# EAGLE design 5_cpu_alu (EAGLE 6.6.0)

## Sheet 1 of 2
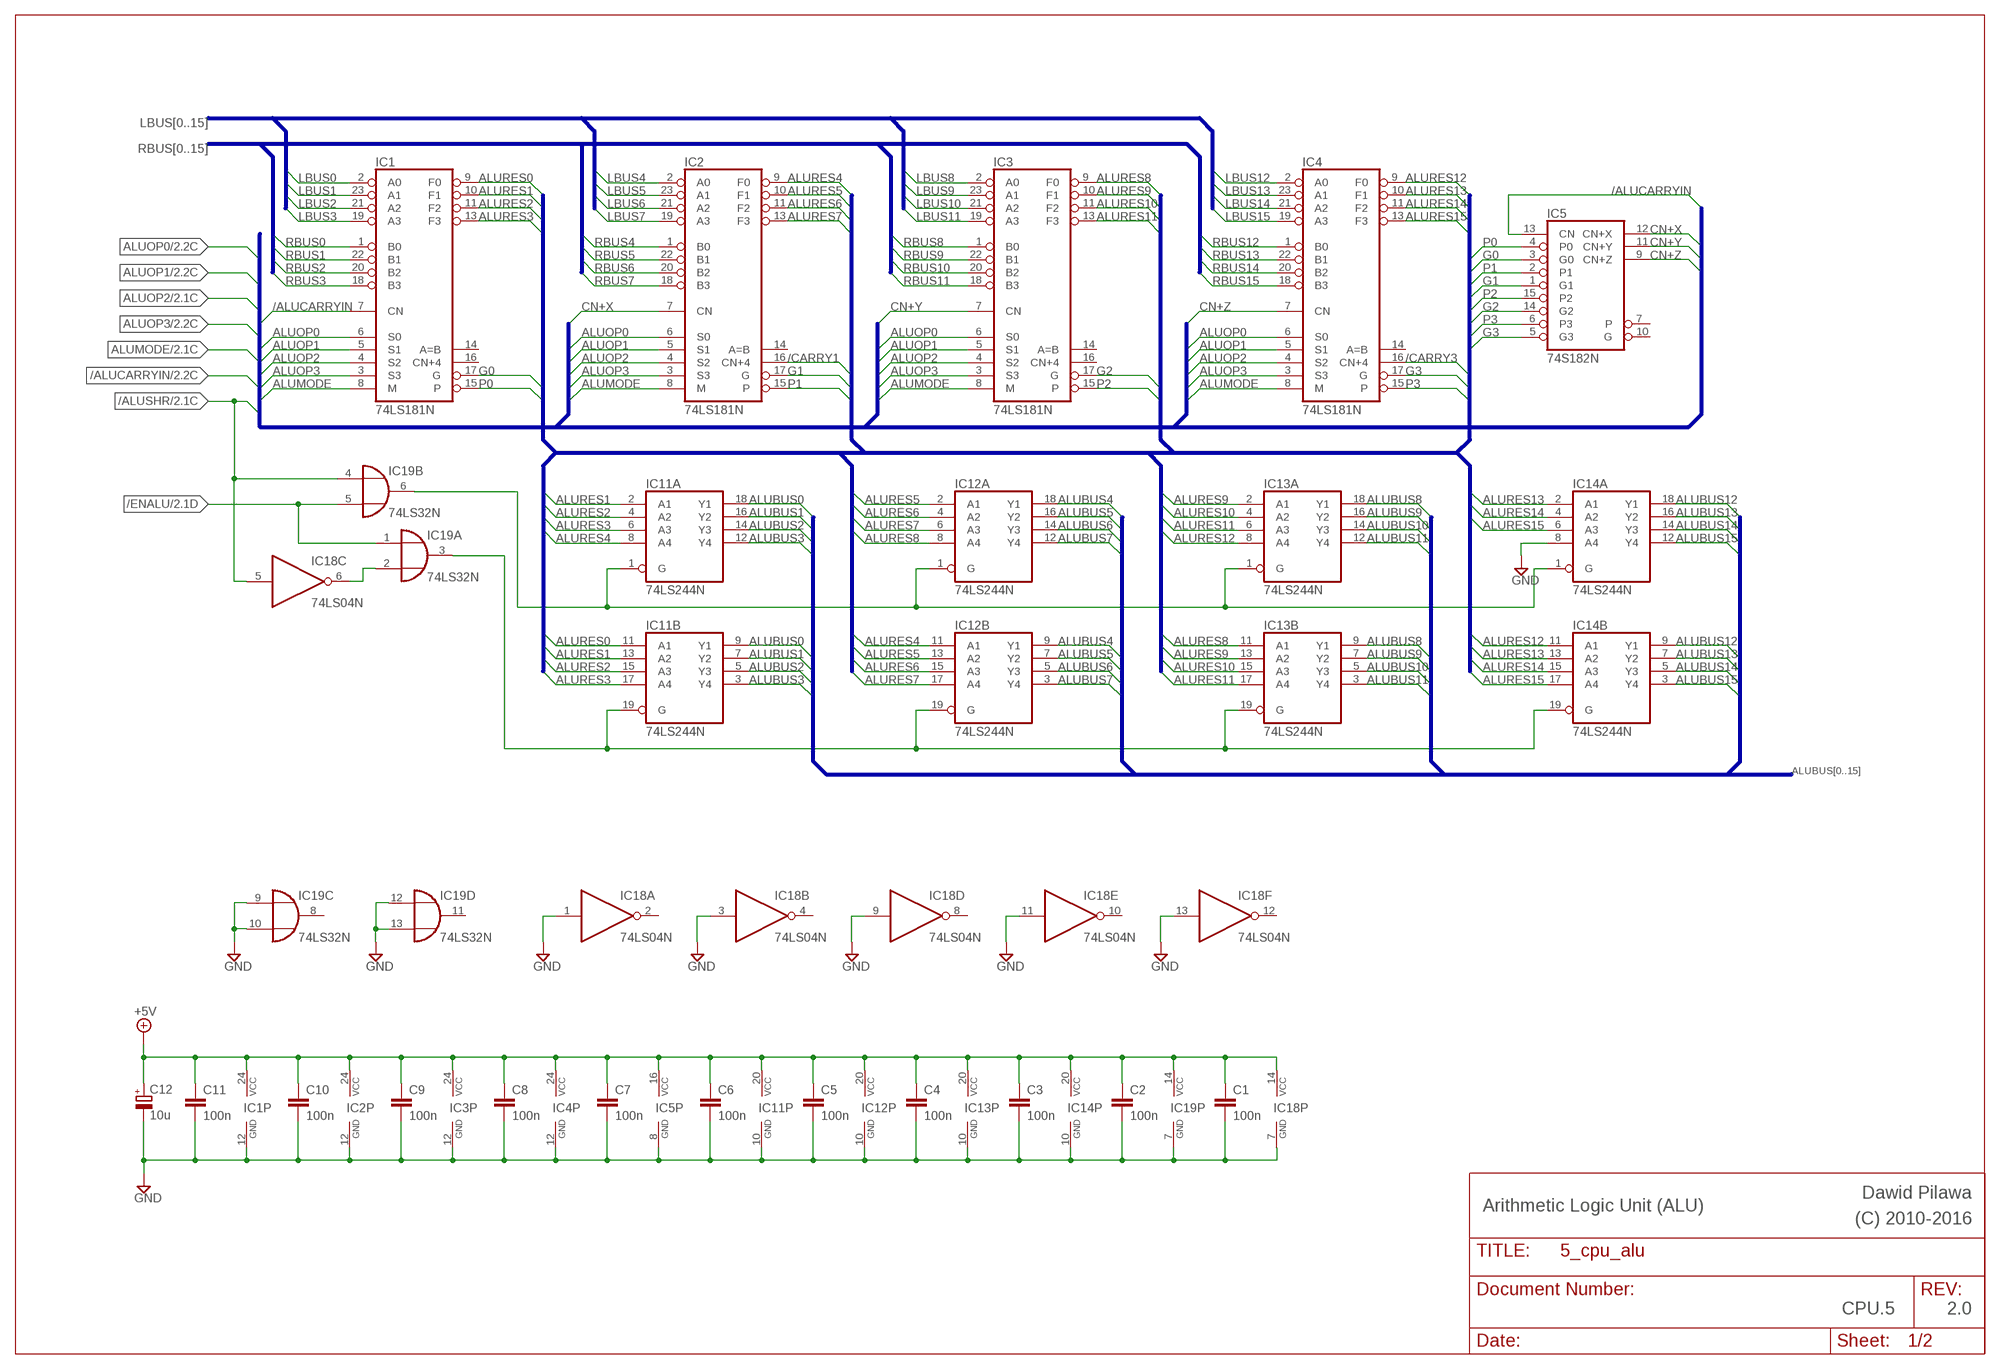
[diagram p0: schematic, sheet 1]

### Parts
C1  100n  C-EU050-024X044  [C050-024X044]
C2  100n  C-EU050-024X044  [C050-024X044]
C3  100n  C-EU050-024X044  [C050-024X044]
C4  100n  C-EU050-024X044  [C050-024X044]
C5  100n  C-EU050-024X044  [C050-024X044]
C6  100n  C-EU050-024X044  [C050-024X044]
C7  100n  C-EU050-024X044  [C050-024X044]
C8  100n  C-EU050-024X044  [C050-024X044]
C9  100n  C-EU050-024X044  [C050-024X044]
C10  100n  C-EU050-024X044  [C050-024X044]
C11  100n  C-EU050-024X044  [C050-024X044]
C12  10u  CPOL-EUE2.5-6  [E2,5-6]
IC1  74LS181N  [DIL24-6]
IC2  74LS181N  [DIL24-6]
IC3  74LS181N  [DIL24-6]
IC4  74LS181N  [DIL24-6]
IC5  74S182N  [DIL16]
IC11  74LS244N  [DIL20]
IC12  74LS244N  [DIL20]
IC13  74LS244N  [DIL20]
IC14  74LS244N  [DIL20]
IC18  74LS04N  [DIL14]
IC19  74LS32N  [DIL14]

### Nets
+5V: C1.1 C2.1 C3.1 C4.1 C5.1 C6.1 C7.1 C8.1 C9.1 C10.1 C11.1 C12.+ IC1.24(VCC) IC2.24(VCC) IC3.24(VCC) IC4.24(VCC) IC5.16(VCC) IC11.20(P:VCC) IC12.20(P:VCC) IC13.20(P:VCC) IC14.20(P:VCC) IC18.14(P:VCC) IC19.14(P:VCC) ; also sheet 2
/ALUCARRYIN: IC1.7(CN) IC5.13(CN) ; also sheet 2
/ALUSHR: IC18.5(C:I) IC19.4(B:I0) ; also sheet 2
/CARRY1: IC2.16(CN+4) ; also sheet 2
/CARRY3: IC4.16(CN+4) ; also sheet 2
/ENALU: IC19.1(A:I0) IC19.5(B:I1) ; also sheet 2
ALUBUS0: IC11.9(B:Y1) IC11.18(A:Y1) ; also sheet 2
ALUBUS1: IC11.7(B:Y2) IC11.16(A:Y2) ; also sheet 2
ALUBUS2: IC11.5(B:Y3) IC11.14(A:Y3) ; also sheet 2
ALUBUS3: IC11.3(B:Y4) IC11.12(A:Y4) ; also sheet 2
ALUBUS4: IC12.9(B:Y1) IC12.18(A:Y1) ; also sheet 2
ALUBUS5: IC12.7(B:Y2) IC12.16(A:Y2) ; also sheet 2
ALUBUS6: IC12.5(B:Y3) IC12.14(A:Y3) ; also sheet 2
ALUBUS7: IC12.3(B:Y4) IC12.12(A:Y4) ; also sheet 2
ALUBUS8: IC13.9(B:Y1) IC13.18(A:Y1) ; also sheet 2
ALUBUS9: IC13.7(B:Y2) IC13.16(A:Y2) ; also sheet 2
ALUBUS10: IC13.5(B:Y3) IC13.14(A:Y3) ; also sheet 2
ALUBUS11: IC13.3(B:Y4) IC13.12(A:Y4) ; also sheet 2
ALUBUS12: IC14.9(B:Y1) IC14.18(A:Y1) ; also sheet 2
ALUBUS13: IC14.7(B:Y2) IC14.16(A:Y2) ; also sheet 2
ALUBUS14: IC14.5(B:Y3) IC14.14(A:Y3) ; also sheet 2
ALUBUS15: IC14.3(B:Y4) IC14.12(A:Y4) ; also sheet 2
ALUMODE: IC1.8(M) IC2.8(M) IC3.8(M) IC4.8(M) ; also sheet 2
ALUOP0: IC1.6(S0) IC2.6(S0) IC3.6(S0) IC4.6(S0) ; also sheet 2
ALUOP1: IC1.5(S1) IC2.5(S1) IC3.5(S1) IC4.5(S1) ; also sheet 2
ALUOP2: IC1.4(S2) IC2.4(S2) IC3.4(S2) IC4.4(S2) ; also sheet 2
ALUOP3: IC1.3(S3) IC2.3(S3) IC3.3(S3) IC4.3(S3) ; also sheet 2
ALURES0: IC1.9(F0) IC11.11(B:A1) ; also sheet 2
ALURES1: IC1.10(F1) IC11.2(A:A1) IC11.13(B:A2)
ALURES2: IC1.11(F2) IC11.4(A:A2) IC11.15(B:A3)
ALURES3: IC1.13(F3) IC11.6(A:A3) IC11.17(B:A4)
ALURES4: IC2.9(F0) IC11.8(A:A4) IC12.11(B:A1)
ALURES5: IC2.10(F1) IC12.2(A:A1) IC12.13(B:A2)
ALURES6: IC2.11(F2) IC12.4(A:A2) IC12.15(B:A3)
ALURES7: IC2.13(F3) IC12.6(A:A3) IC12.17(B:A4)
ALURES8: IC3.9(F0) IC12.8(A:A4) IC13.11(B:A1) ; also sheet 2
ALURES9: IC3.10(F1) IC13.2(A:A1) IC13.13(B:A2)
ALURES10: IC3.11(F2) IC13.4(A:A2) IC13.15(B:A3)
ALURES11: IC3.13(F3) IC13.6(A:A3) IC13.17(B:A4)
ALURES12: IC4.9(F0) IC13.8(A:A4) IC14.11(B:A1)
ALURES13: IC4.10(F1) IC14.2(A:A1) IC14.13(B:A2)
ALURES14: IC4.11(F2) IC14.4(A:A2) IC14.15(B:A3)
ALURES15: IC4.13(F3) IC14.6(A:A3) IC14.17(B:A4)
CN+X: IC2.7(CN) IC5.12(CN+X)
CN+Y: IC3.7(CN) IC5.11(CN+Y)
CN+Z: IC4.7(CN) IC5.9(CN+Z)
G0: IC1.17(G) IC5.3(G0)
G1: IC2.17(G) IC5.1(G1)
G2: IC3.17(G) IC5.14(G2)
G3: IC4.17(G) IC5.5(G3)
GND: C1.2 C2.2 C3.2 C4.2 C5.2 C6.2 C7.2 C8.2 C9.2 C10.2 C11.2 C12.- IC1.12(GND) IC2.12(GND) IC3.12(GND) IC4.12(GND) IC5.8(GND) IC11.10(P:GND) IC12.10(P:GND) IC13.10(P:GND) IC14.8(A:A4) IC14.10(P:GND) IC18.1(A:I) IC18.3(B:I) IC18.7(P:GND) IC18.9(D:I) IC18.11(E:I) IC18.13(F:I) IC19.7(P:GND) IC19.9(C:I0) IC19.10(C:I1) IC19.12(D:I0) IC19.13(D:I1) ; also sheet 2
LBUS0: IC1.2(A0) ; also sheet 2
LBUS1: IC1.23(A1) ; also sheet 2
LBUS2: IC1.21(A2) ; also sheet 2
LBUS3: IC1.19(A3) ; also sheet 2
LBUS4: IC2.2(A0) ; also sheet 2
LBUS5: IC2.23(A1) ; also sheet 2
LBUS6: IC2.21(A2) ; also sheet 2
LBUS7: IC2.19(A3) ; also sheet 2
LBUS8: IC3.2(A0) ; also sheet 2
LBUS9: IC3.23(A1) ; also sheet 2
LBUS10: IC3.21(A2) ; also sheet 2
LBUS11: IC3.19(A3) ; also sheet 2
LBUS12: IC4.2(A0) ; also sheet 2
LBUS13: IC4.23(A1) ; also sheet 2
LBUS14: IC4.21(A2) ; also sheet 2
LBUS15: IC4.19(A3) ; also sheet 2
N$1: IC11.1(A:G) IC12.1(A:G) IC13.1(A:G) IC14.1(A:G) IC19.6(B:O)
N$4: IC18.6(C:O) IC19.2(A:I1)
N$5: IC11.19(B:G) IC12.19(B:G) IC13.19(B:G) IC14.19(B:G) IC19.3(A:O)
P0: IC1.15(P) IC5.4(P0)
P1: IC2.15(P) IC5.2(P1)
P2: IC3.15(P) IC5.15(P2)
P3: IC4.15(P) IC5.6(P3)
RBUS0: IC1.1(B0) ; also sheet 2
RBUS1: IC1.22(B1) ; also sheet 2
RBUS2: IC1.20(B2) ; also sheet 2
RBUS3: IC1.18(B3) ; also sheet 2
RBUS4: IC2.1(B0) ; also sheet 2
RBUS5: IC2.22(B1) ; also sheet 2
RBUS6: IC2.20(B2) ; also sheet 2
RBUS7: IC2.18(B3) ; also sheet 2
RBUS8: IC3.1(B0) ; also sheet 2
RBUS9: IC3.22(B1) ; also sheet 2
RBUS10: IC3.20(B2) ; also sheet 2
RBUS11: IC3.18(B3) ; also sheet 2
RBUS12: IC4.1(B0) ; also sheet 2
RBUS13: IC4.22(B1) ; also sheet 2
RBUS14: IC4.20(B2) ; also sheet 2
RBUS15: IC4.18(B3) ; also sheet 2
Unconnected: IC1.14(A=B) IC1.16(CN+4) IC2.14(A=B) IC3.14(A=B) IC3.16(CN+4) IC4.14(A=B) IC5.7(P) IC5.10(G) IC18.2(A:O) IC18.4(B:O) IC18.8(D:O) IC18.10(E:O) IC18.12(F:O) IC19.8(C:O) IC19.11(D:O)

### Buses
RBUS[0..15]
LBUS[0..15]
ALUOP[0..3],ALUMODE,/ALUSHR,/ALUCARRYIN,CN+X,CN+Y,CN+Z
ALURES[0..15],/CARRY[0..3],P[0..3],G[0..3]
ALUBUS[0..15]

### Notes on the sheet
- Dawid Pilawa
- Arithmetic Logic Unit (ALU) | (C) 2010-2016
- CPU.5 | 2.0

## Sheet 2 of 2
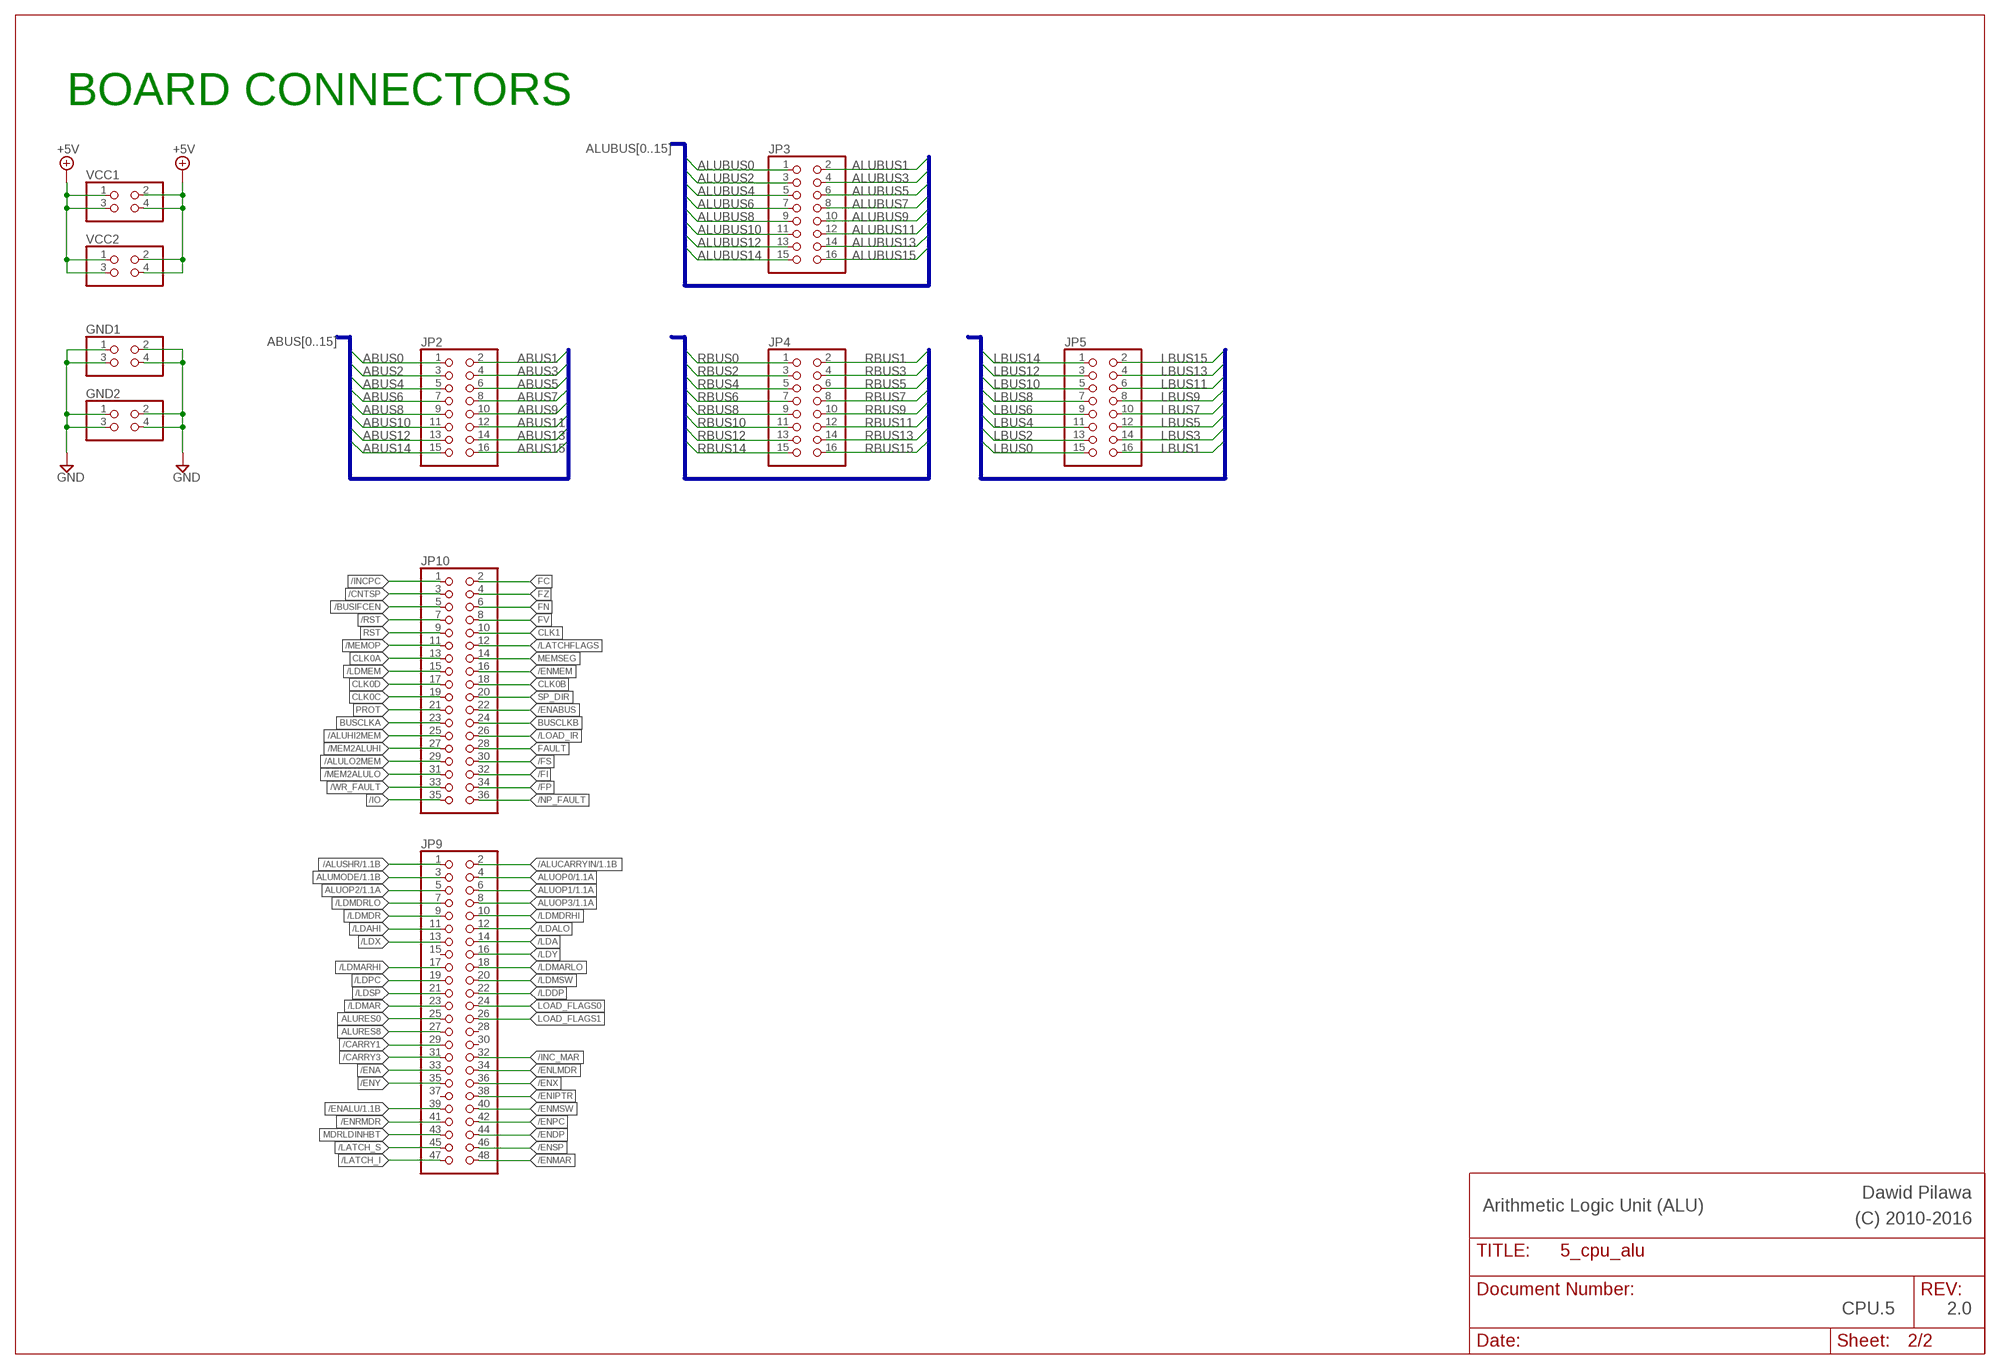
[diagram p1: schematic, sheet 2]

### Parts
GND1  PINHD-2X2  [2X02]
GND2  PINHD-2X2  [2X02]
JP2  PINHD-2X8  [2X08]
JP3  PINHD-2X8  [2X08]
JP4  PINHD-2X8  [2X08]
JP5  PINHD-2X8  [2X08]
JP9  PINHD-2X24  [2X24]
JP10  PINHD-2X18  [2X18]
VCC1  PINHD-2X2  [2X02]
VCC2  PINHD-2X2  [2X02]

### Nets
+5V: VCC1.1 VCC1.2 VCC1.3 VCC1.4 VCC2.1 VCC2.2 VCC2.3 VCC2.4 ; also sheet 1
/ALUCARRYIN: JP9.2 ; also sheet 1
/ALUHI2MEM: JP10.25
/ALULO2MEM: JP10.29
/ALUSHR: JP9.1 ; also sheet 1
/BUSIFCEN: JP10.5
/CARRY1: JP9.29 ; also sheet 1
/CARRY3: JP9.31 ; also sheet 1
/CNTSP: JP10.3
/ENA: JP9.33
/ENABUS: JP10.22
/ENALU: JP9.39 ; also sheet 1
/ENDP: JP9.44
/ENIPTR: JP9.38
/ENLMDR: JP9.34
/ENMAR: JP9.48
/ENMEM: JP10.16
/ENMSW: JP9.40
/ENPC: JP9.42
/ENRMDR: JP9.41
/ENSP: JP9.46
/ENX: JP9.36
/ENY: JP9.35
/FI: JP10.32
/FP: JP10.34
/FS: JP10.30
/INC_MAR: JP9.32
/INCPC: JP10.1
/IO: JP10.35
/LATCH_I: JP9.47
/LATCH_S: JP9.45
/LATCHFLAGS: JP10.12
/LDA: JP9.14
/LDAHI: JP9.11
/LDALO: JP9.12
/LDDP: JP9.22
/LDMAR: JP9.23
/LDMARHI: JP9.17
/LDMARLO: JP9.18
/LDMDR: JP9.9
/LDMDRHI: JP9.10
/LDMDRLO: JP9.7
/LDMEM: JP10.15
/LDMSW: JP9.20
/LDPC: JP9.19
/LDSP: JP9.21
/LDX: JP9.13
/LDY: JP9.16
/LOAD_IR: JP10.26
/MEM2ALUHI: JP10.27
/MEM2ALULO: JP10.31
/MEMOP: JP10.11
/NP_FAULT: JP10.36
/RST: JP10.7
/WR_FAULT: JP10.33
ABUS0: JP2.1
ABUS1: JP2.2
ABUS2: JP2.3
ABUS3: JP2.4
ABUS4: JP2.5
ABUS5: JP2.6
ABUS6: JP2.7
ABUS7: JP2.8
ABUS8: JP2.9
ABUS9: JP2.10
ABUS10: JP2.11
ABUS11: JP2.12
ABUS12: JP2.13
ABUS13: JP2.14
ABUS14: JP2.15
ABUS15: JP2.16
ALUBUS0: JP3.1 ; also sheet 1
ALUBUS1: JP3.2 ; also sheet 1
ALUBUS2: JP3.3 ; also sheet 1
ALUBUS3: JP3.4 ; also sheet 1
ALUBUS4: JP3.5 ; also sheet 1
ALUBUS5: JP3.6 ; also sheet 1
ALUBUS6: JP3.7 ; also sheet 1
ALUBUS7: JP3.8 ; also sheet 1
ALUBUS8: JP3.9 ; also sheet 1
ALUBUS9: JP3.10 ; also sheet 1
ALUBUS10: JP3.11 ; also sheet 1
ALUBUS11: JP3.12 ; also sheet 1
ALUBUS12: JP3.13 ; also sheet 1
ALUBUS13: JP3.14 ; also sheet 1
ALUBUS14: JP3.15 ; also sheet 1
ALUBUS15: JP3.16 ; also sheet 1
ALUMODE: JP9.3 ; also sheet 1
ALUOP0: JP9.4 ; also sheet 1
ALUOP1: JP9.6 ; also sheet 1
ALUOP2: JP9.5 ; also sheet 1
ALUOP3: JP9.8 ; also sheet 1
ALURES0: JP9.25 ; also sheet 1
ALURES8: JP9.27 ; also sheet 1
BUSCLKA: JP10.23
BUSCLKB: JP10.24
CLK0A: JP10.13
CLK0B: JP10.18
CLK0C: JP10.19
CLK0D: JP10.17
CLK1: JP10.10
FAULT: JP10.28
FC: JP10.2
FN: JP10.6
FV: JP10.8
FZ: JP10.4
GND: GND1.1 GND1.2 GND1.3 GND1.4 GND2.1 GND2.2 GND2.3 GND2.4 ; also sheet 1
LBUS0: JP5.15 ; also sheet 1
LBUS1: JP5.16 ; also sheet 1
LBUS2: JP5.13 ; also sheet 1
LBUS3: JP5.14 ; also sheet 1
LBUS4: JP5.11 ; also sheet 1
LBUS5: JP5.12 ; also sheet 1
LBUS6: JP5.9 ; also sheet 1
LBUS7: JP5.10 ; also sheet 1
LBUS8: JP5.7 ; also sheet 1
LBUS9: JP5.8 ; also sheet 1
LBUS10: JP5.5 ; also sheet 1
LBUS11: JP5.6 ; also sheet 1
LBUS12: JP5.3 ; also sheet 1
LBUS13: JP5.4 ; also sheet 1
LBUS14: JP5.1 ; also sheet 1
LBUS15: JP5.2 ; also sheet 1
LOAD_FLAGS0: JP9.24
LOAD_FLAGS1: JP9.26
MDRLDINHBT: JP9.43
MEMSEG: JP10.14
PROT: JP10.21
RBUS0: JP4.1 ; also sheet 1
RBUS1: JP4.2 ; also sheet 1
RBUS2: JP4.3 ; also sheet 1
RBUS3: JP4.4 ; also sheet 1
RBUS4: JP4.5 ; also sheet 1
RBUS5: JP4.6 ; also sheet 1
RBUS6: JP4.7 ; also sheet 1
RBUS7: JP4.8 ; also sheet 1
RBUS8: JP4.9 ; also sheet 1
RBUS9: JP4.10 ; also sheet 1
RBUS10: JP4.11 ; also sheet 1
RBUS11: JP4.12 ; also sheet 1
RBUS12: JP4.13 ; also sheet 1
RBUS13: JP4.14 ; also sheet 1
RBUS14: JP4.15 ; also sheet 1
RBUS15: JP4.16 ; also sheet 1
RST: JP10.9
SP_DIR: JP10.20
Unconnected: JP9.15 JP9.28 JP9.30 JP9.37

### Buses
RBUS[0..15]
LBUS[0..15]
ALUBUS[0..15]
ABUS[0..15]

### Notes on the sheet
- BOARD CONNECTORS
- Dawid Pilawa
- Arithmetic Logic Unit (ALU) | (C) 2010-2016
- CPU.5 | 2.0

## Library data of the parts
C1-C11 = rcl:C-EU: CAPACITOR, European symbol
C12 = rcl:CPOL-EU: POLARIZED CAPACITOR, European symbol
GND1 GND2 VCC1 VCC2 = pinhead:PINHD-2X2: PIN HEADER
IC1-IC4 = 74xx-eu:74*181: ARITHMETIC LOGIC UNIT function generator
IC5 = 74xx-eu:74*182: LOOK AHEAD CARRY GENERATOR
IC11-IC14 = 74xx-eu:74*244: Octal BUFFER and LINE DRIVER, 3-state
IC18 = 74xx-eu:74*04: Hex INVERTER
IC19 = 74xx-eu:74*32: Quad 2-input OR gate
JP2-JP5 = pinhead:PINHD-2X8: PIN HEADER
JP9 = pinhead:PINHD-2X24: PIN HEADER
JP10 = pinhead:PINHD-2X18: PIN HEADER

## Board
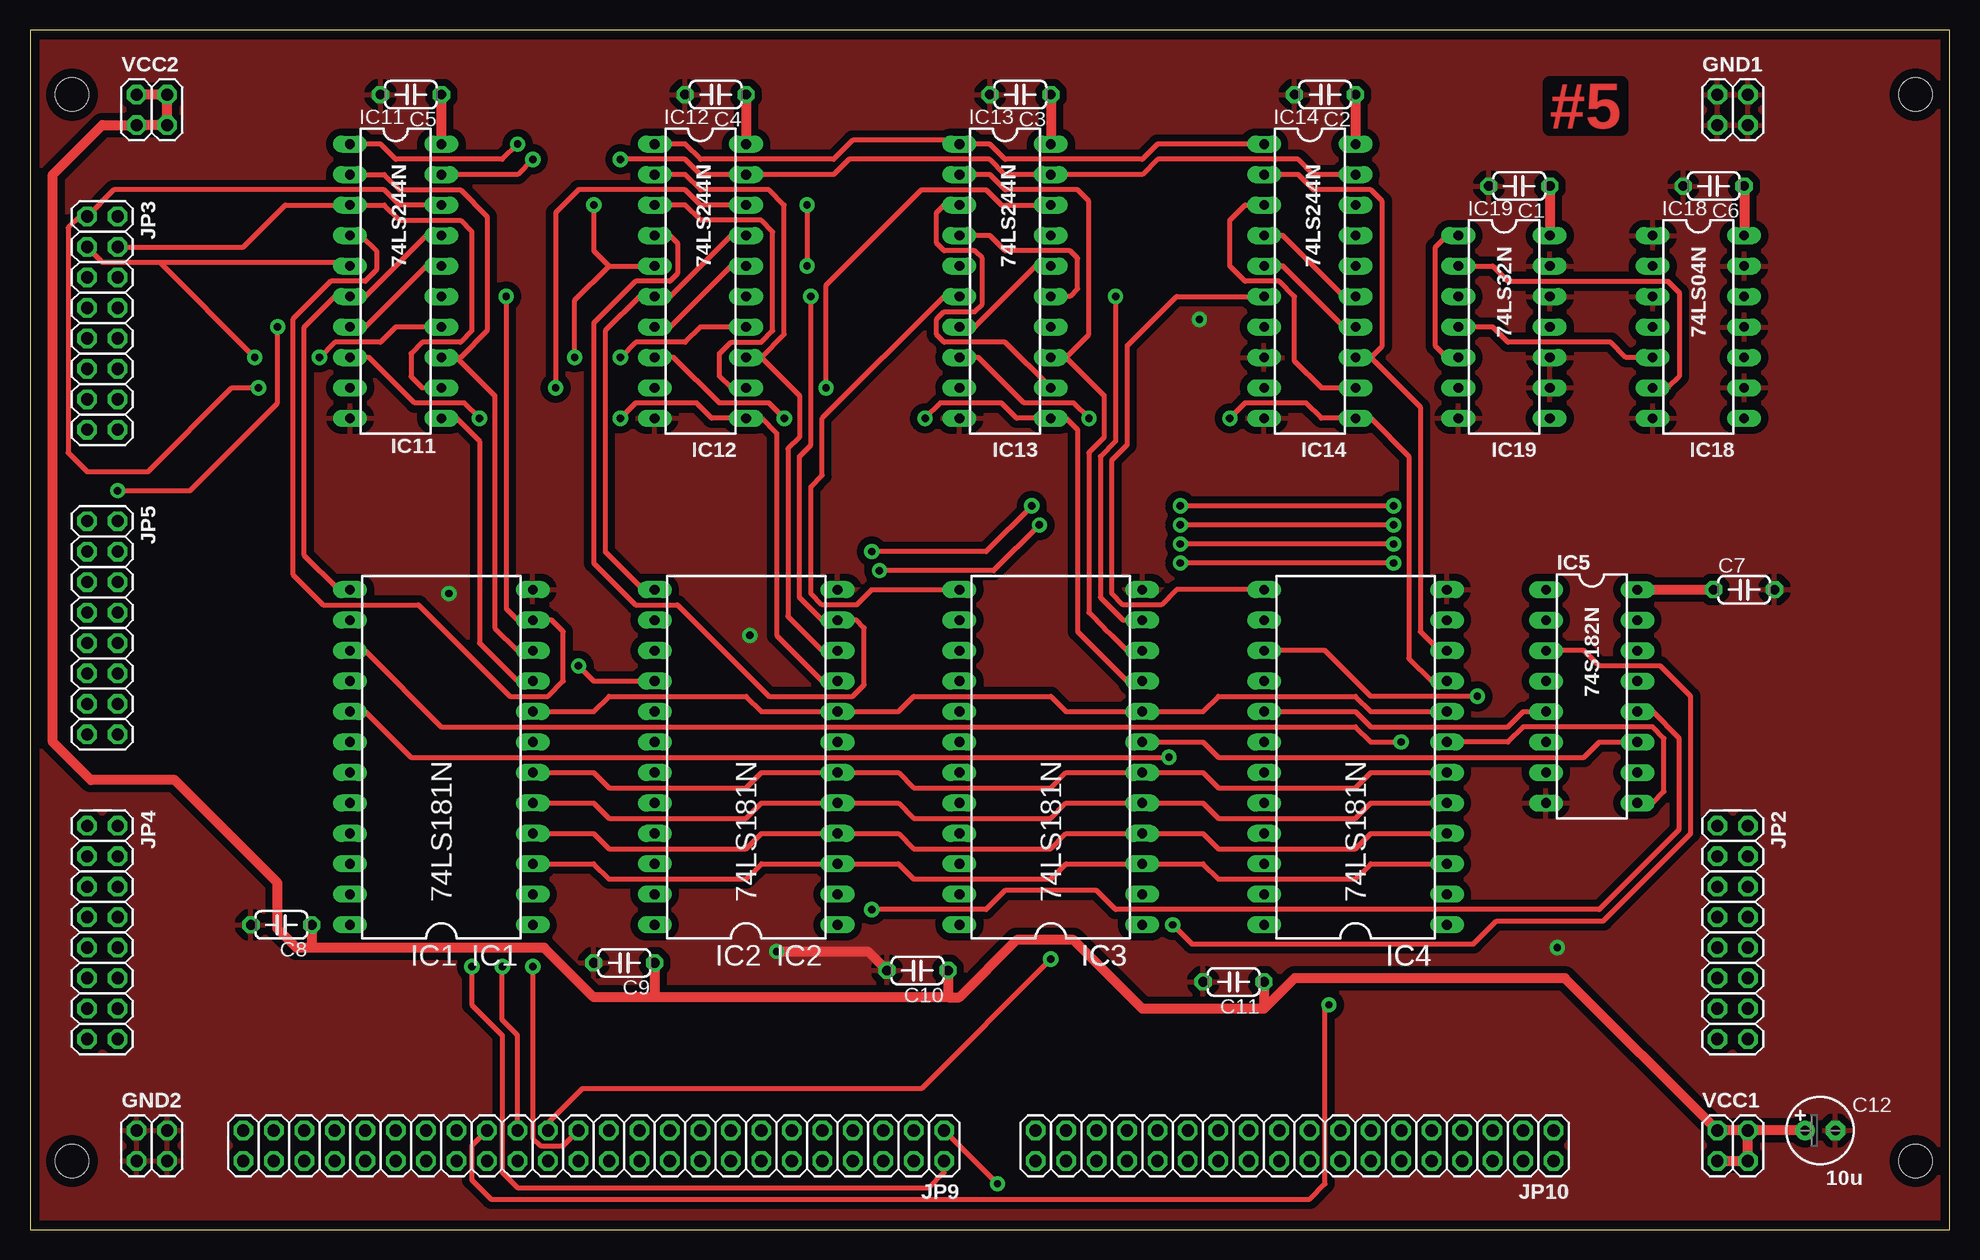
[diagram p2: board, top side]
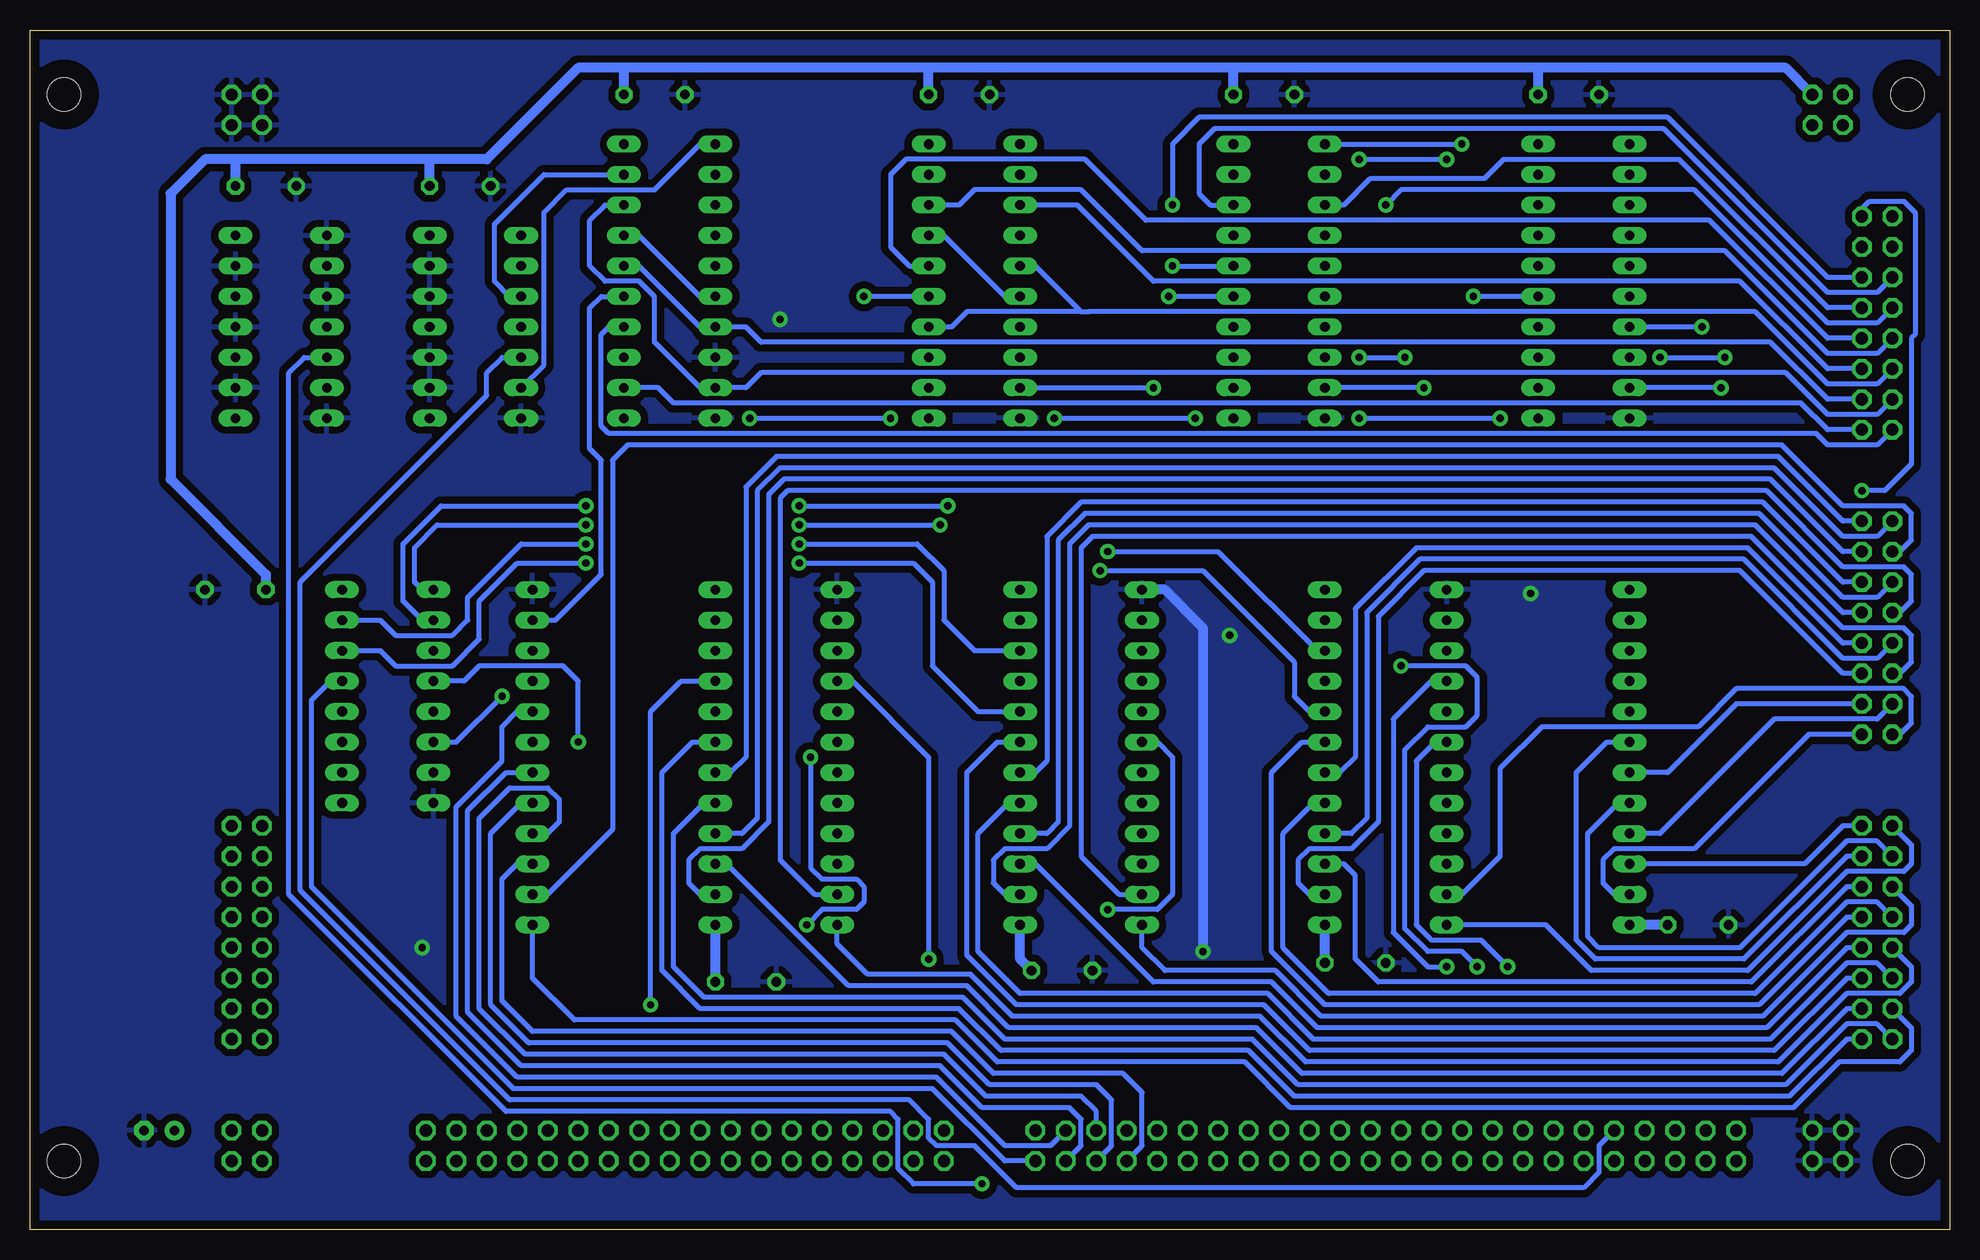
[diagram p3: board, bottom side, seen from below]

Size 160 x 100 mm. Coordinates in mm from the lower left corner, seen from the top.
Outline: 0,0 160,0 160,100 0,100 0,0
Copper layers (1*16): Top 0.035mm / dielectric 1.5mm / Bottom 0.035mm
Design rules "homebrew_pcb": minimum track width 16mil, minimum drill 24mil, track to track 16mil, track to pad 10mil, pad to pad 10mil, via to via 10mil, smd to smd 8mil, copper to edge 30mil, drill to drill 10mil, minimum pad ring 12mil, minimum via ring 12mil, stop-mask expansion 4mil, vias tented up to drill 0mil, thermal gap 24mil
Holes 2.79 mm at 3.49,94.61 3.49,5.71 157.16,5.71 157.16,94.61
bRestrict: area 1.2,92.3 to 5.8,96.9; area 1.2,3.4 to 5.8,8; area 154.9,3.4 to 159.4,8; area 154.9,92.3 to 159.4,96.9
vRestrict: area 1.2,92.3 to 5.8,96.9; area 1.2,3.4 to 5.8,8; area 154.9,3.4 to 159.4,8; area 154.9,92.3 to 159.4,96.9

### Footprints (pad centres in the part's own frame; a part is rotated, then mirrored left to right if it is on the bottom)
C050-024X044 = drill 0.813 octagon: 1 -2.54,0; 2 2.54,0
E2,5-6 = drill 0.813 pad 1.6: + -1.27,0 | drill 0.813 pad 1.6 octagon: - 1.27,0
2X02 = drill 1.016 octagon: 1 -1.27,-1.27; 2 -1.27,1.27; 3 1.27,-1.27; 4 1.27,1.27
DIL24-6 = drill 0.813 long: 1 -13.97,-7.62; 2 -11.43,-7.62; 3 -8.89,-7.62; 4 -6.35,-7.62; 5 -3.81,-7.62; 6 -1.27,-7.62; 7 1.27,-7.62; 8 3.81,-7.62; 9 6.35,-7.62; 10 8.89,-7.62; 11 11.43,-7.62; 12 13.97,-7.62; 13 13.97,7.62; 14 11.43,7.62; 15 8.89,7.62; 16 6.35,7.62; 17 3.81,7.62; 18 1.27,7.62; 19 -1.27,7.62; 20 -3.81,7.62; 21 -6.35,7.62; 22 -8.89,7.62; 23 -11.43,7.62; 24 -13.97,7.62
DIL16 = drill 0.813 long: 1 -8.89,-3.81; 2 -6.35,-3.81; 3 -3.81,-3.81; 4 -1.27,-3.81; 5 1.27,-3.81; 6 3.81,-3.81; 7 6.35,-3.81; 8 8.89,-3.81; 9 8.89,3.81; 10 6.35,3.81; 11 3.81,3.81; 12 1.27,3.81; 13 -1.27,3.81; 14 -3.81,3.81; 15 -6.35,3.81; 16 -8.89,3.81
DIL20 = drill 0.813 long: 1 -11.43,-3.81; 2 -8.89,-3.81; 3 -6.35,-3.81; 4 -3.81,-3.81; 5 -1.27,-3.81; 6 1.27,-3.81; 7 3.81,-3.81; 8 6.35,-3.81; 9 8.89,-3.81; 10 11.43,-3.81; 11 11.43,3.81; 12 8.89,3.81; 13 6.35,3.81; 14 3.81,3.81; 15 1.27,3.81; 16 -1.27,3.81; 17 -3.81,3.81; 18 -6.35,3.81; 19 -8.89,3.81; 20 -11.43,3.81
DIL14 = drill 0.813 long: 1 -7.62,-3.81; 2 -5.08,-3.81; 3 -2.54,-3.81; 4 0,-3.81; 5 2.54,-3.81; 6 5.08,-3.81; 7 7.62,-3.81; 8 7.62,3.81; 9 5.08,3.81; 10 2.54,3.81; 11 0,3.81; 12 -2.54,3.81; 13 -5.08,3.81; 14 -7.62,3.81
2X08 = drill 1.016 octagon: 1 -8.89,-1.27; 2 -8.89,1.27; 3 -6.35,-1.27; 4 -6.35,1.27; 5 -3.81,-1.27; 6 -3.81,1.27; 7 -1.27,-1.27; 8 -1.27,1.27; 9 1.27,-1.27; 10 1.27,1.27; 11 3.81,-1.27; 12 3.81,1.27; 13 6.35,-1.27; 14 6.35,1.27; 15 8.89,-1.27; 16 8.89,1.27
2X24 = drill 1.016 octagon: 1 -27.94,-1.27; 2 -27.94,1.27; 3 -25.4,-1.27; 4 -25.4,1.27; 5 -22.86,-1.27; 6 -22.86,1.27; 7 -20.32,-1.27; 8 -20.32,1.27; 9 -17.78,-1.27; 10 -17.78,1.27; 11 -15.24,-1.27; 12 -15.24,1.27; 13 -12.7,-1.27; 14 -12.7,1.27; 15 -10.16,-1.27; 16 -10.16,1.27; 17 -7.62,-1.27; 18 -7.62,1.27; 19 -5.08,-1.27; 20 -5.08,1.27; 21 -2.54,-1.27; 22 -2.54,1.27; 23 0,-1.27; 24 0,1.27; 25 2.54,-1.27; 26 2.54,1.27; 27 5.08,-1.27; 28 5.08,1.27; 29 7.62,-1.27; 30 7.62,1.27; 31 10.16,-1.27; 32 10.16,1.27; 33 12.7,-1.27; 34 12.7,1.27; 35 15.24,-1.27; 36 15.24,1.27; 37 17.78,-1.27; 38 17.78,1.27; 39 20.32,-1.27; 40 20.32,1.27; 41 22.86,-1.27; 42 22.86,1.27; 43 25.4,-1.27; 44 25.4,1.27; 45 27.94,-1.27; 46 27.94,1.27; 47 30.48,-1.27; 48 30.48,1.27
2X18 = drill 1.016 octagon: 1 -21.59,-1.27; 2 -21.59,1.27; 3 -19.05,-1.27; 4 -19.05,1.27; 5 -16.51,-1.27; 6 -16.51,1.27; 7 -13.97,-1.27; 8 -13.97,1.27; 9 -11.43,-1.27; 10 -11.43,1.27; 11 -8.89,-1.27; 12 -8.89,1.27; 13 -6.35,-1.27; 14 -6.35,1.27; 15 -3.81,-1.27; 16 -3.81,1.27; 17 -1.27,-1.27; 18 -1.27,1.27; 19 1.27,-1.27; 20 1.27,1.27; 21 3.81,-1.27; 22 3.81,1.27; 23 6.35,-1.27; 24 6.35,1.27; 25 8.89,-1.27; 26 8.89,1.27; 27 11.43,-1.27; 28 11.43,1.27; 29 13.97,-1.27; 30 13.97,1.27; 31 16.51,-1.27; 32 16.51,1.27; 33 19.05,-1.27; 34 19.05,1.27; 35 21.59,-1.27; 36 21.59,1.27

### Placement (x,y rotation side)
C1  124.14,87 180 top
C2  107.95,94.61 180 top
C3  82.55,94.61 180 top
C4  57.15,94.61 180 top
C5  31.75,94.61 180 top
C6  140.34,87 180 top
C7  142.88,53.34 0 top
C8  20.95,25.4 180 top
C9  49.53,22.23 180 top
C10  73.98,21.59 180 top
C11  100.33,20.64 180 top
C12  149.22,8.26 0 top
GND1  141.92,93.34 0 top
GND2  10.16,6.99 0 top
IC1  34.29,39.37 90 top
IC2  59.69,39.37 90 top
IC3  85.09,39.37 90 top
IC4  110.49,39.37 90 top
IC5  130.18,44.45 270 top
IC11  30.48,79.06 270 top
IC12  55.88,79.06 270 top
IC13  81.28,79.06 270 top
IC14  106.68,79.06 270 top
IC18  139.06,75.25 270 top
IC19  122.87,75.25 270 top
JP2  141.92,24.77 270 top
JP3  6.03,75.56 270 top
JP4  6.03,24.77 270 top
JP5  6.03,50.16 270 top
JP9  48.26,6.99 180 top
JP10  105.41,6.99 180 top
VCC1  141.92,6.99 0 top
VCC2  10.16,93.34 0 top

### Tracks (layer width: path | path; a pad name or v marks a point on that pad's centre or on a via)
+5V
  Top 0.813: C12.+ VCC1.4 | VCC1.1 VCC1.3 VCC1.4 | VCC1.4 VCC1.2 127.95,20.95 105.41,20.95 102.87,18.41 | 76.52,19.37 52.07,19.37 | VCC2.2 VCC2.4 VCC2.3 VCC2.1 6.03,92.08 1.91,87.95 1.91,40.64 5.08,37.47 12.06,37.47 20.64,28.89 20.64,25.08 22.23,23.5 23.5,23.5 | IC5.16 C7.1 | C6.1 IC18.14 | C1.1 IC19.14 | C2.1 IC14.20 | C3.1 IC13.20 | C4.1 IC12.20 | C5.1 IC11.20 | C9.1 52.07,19.37 | C10.1 76.52,19.37 | C11.1 102.87,18.41 | 102.87,18.41 92.71,18.41 87,24.13 82.23,24.13 77.47,19.37 76.52,19.37 | 52.07,19.37 46.99,19.37 42.86,23.5 23.5,23.5 | C8.1 23.5,23.5
  Bottom 0.813: VCC2.4 13.65,96.84 34.29,96.84 | 34.29,96.84 59.69,96.84 | 59.69,96.84 85.09,96.84 | 85.09,96.84 110.49,96.84 | 110.49,96.84 114.3,96.84 121.92,89.22 126.68,89.22 | 126.68,89.22 142.88,89.22 | 142.88,89.22 145.41,89.22 148.27,86.36 148.27,62.55 140.34,54.61 C7.1 | C6.1 142.88,89.22 | C1.1 126.68,89.22 | C2.1 110.49,96.84 | C3.1 85.09,96.84 | C4.1 59.69,96.84 | C5.1 34.29,96.84 | C8.1 IC1.24 | C9.1 IC2.24 | C11.1 IC4.24 | C10.1 77.47,22.54 IC3.24
/ALUCARRYIN  (via drill 0.61 pad 1.27)
  Top 0.406: v36.83,21.91 36.83,18.73 39.37,16.19 39.37,4.76 40.64,3.49 74.93,3.49 76.2,4.76 JP9.2
  Bottom 0.406: JP9.2 78.74,5.71 84.77,11.75 119.7,11.75 136.53,28.57 136.53,44.13 134.94,45.72 IC5.13 | IC1.7 42.86,40.64 44.45,39.05 44.45,25.4 43.18,24.13 39.05,24.13 v36.83,21.91
/ALUSHR  (via drill 0.61 pad 1.27)
  Top 0.406: IC18.5 133.03,72.71 131.76,73.98 123.19,73.98 121.92,75.25 IC19.4 | JP9.1 v80.64,3.81
  Bottom 0.406: IC18.5 137.16,72.71 138.43,71.44 138.43,27.94 120.33,9.84 88.27,9.84 87.63,9.21 87.63,5.08 86.36,3.81 v80.64,3.81
/CARRY1  (via drill 0.61 pad 1.27)
  Top 0.406: JP9.29 40.64,16.19 39.37,17.46 v39.37,21.91 | v45.72,46.99 46.99,45.72 IC2.16
  Bottom 0.406: v39.37,21.91 40.64,23.18 43.5,23.18 45.4,25.08 45.4,40.01 43.5,41.91 40.32,41.91 39.37,42.86 39.37,46.04 40.32,46.99 v45.72,46.99
/CARRY3  (via drill 0.61 pad 1.27)
  Top 0.406: JP9.31 36.83,6.99 36.83,4.13 38.42,2.54 106.68,2.54 107.95,3.81 107.95,18.41 v108.27,18.73
  Bottom 0.406: v108.27,18.73 108.27,43.18 105.73,45.72 IC4.16
/ENALU
  Top 0.406: IC19.5 118.11,72.71 117.16,73.66 117.16,81.92 118.11,82.87 IC19.1
  Bottom 0.406: JP9.39 29.21,6.99 29.21,4.76 30.48,3.49 77.79,3.49 81.28,6.99 84.45,6.99 85.09,7.62 85.09,9.21 86.68,10.79 120.02,10.79 137.48,28.26 137.48,53.98 121.92,69.53 121.92,71.44 120.65,72.71 IC19.5
ALUBUS0  (via drill 0.61 pad 1.27)
  Top 0.406: v19.05,70.17 16.83,70.17 9.84,63.18 4.76,63.18 3.17,64.77 3.17,83.5 4.13,84.45 JP3.1 6.99,86.68 29.53,86.68 30.8,85.41 IC11.18
  Bottom 0.406: v19.05,70.17 IC11.9
ALUBUS1  (via drill 0.61 pad 1.27)
  Top 0.406: v7.3,61.59 13.34,61.59 20.64,68.9 v20.64,75.25 | IC11.7 27.94,75.25 33.02,80.33 IC11.16
  Bottom 0.406: JP3.2 7.3,85.09 6.67,85.72 3.81,85.72 2.86,84.77 2.86,74.61 3.17,74.3 3.17,63.82 5.4,61.59 v7.3,61.59 | v20.64,75.25 IC11.7
ALUBUS2  (via drill 0.61 pad 1.27)
  Top 0.406: JP3.3 6.03,80.64 10.79,80.64 | 10.79,80.64 26.35,80.64 IC11.5 | IC11.14 30.48,75.25 29.21,73.98 25.4,73.98 v24.13,72.71 | v18.73,72.71 10.79,80.64
  Bottom 0.406: v24.13,72.71 v18.73,72.71
ALUBUS3
  Top 0.406: JP3.4 17.78,81.92 21.27,85.41 IC11.3 29.53,85.41 30.8,84.14 35.88,84.14 36.83,83.19 36.83,74.93 35.88,73.98 32.7,73.98 31.75,73.03 31.75,71.12 32.7,70.17 IC11.12
ALUBUS4  (via drill 0.61 pad 1.27)
  Top 0.406: IC12.18 55.88,85.41 54.61,86.68 45.72,86.68 43.81,84.77 v43.81,70.17
  Bottom 0.406: JP3.5 6.03,78.11 10.16,78.11 23.81,91.76 61.28,91.76 62.55,90.49 62.55,86.36 61.59,85.41 IC12.18 | v43.81,70.17 IC12.9
ALUBUS5  (via drill 0.61 pad 1.27)
  Top 0.406: IC12.7 53.34,75.25 58.42,80.33 IC12.16 | v64.77,85.41 v64.77,80.33
  Bottom 0.406: JP3.6 10.16,79.38 23.5,92.71 62.55,92.71 64.77,90.49 v64.77,85.41 | v64.77,80.33 IC12.16
ALUBUS6  (via drill 0.61 pad 1.27)
  Top 0.406: v46.99,85.41 46.99,81.6 48.26,80.33 | IC12.14 55.88,75.25 54.61,73.98 50.48,73.98 v49.21,72.71 | v45.4,72.71 45.4,77.47 48.26,80.33 | 48.26,80.33 IC12.5
  Bottom 0.406: JP3.7 6.03,75.56 10.16,75.56 21.27,86.68 45.72,86.68 v46.99,85.41 | v49.21,72.71 v45.4,72.71
ALUBUS7
  Top 0.406: IC12.12 58.42,70.17 57.47,71.12 57.47,73.03 58.42,73.98 60.96,73.98 61.91,74.93 61.91,83.19 60.96,84.14 55.88,84.14 54.61,85.41 IC12.3
  Bottom 0.406: JP3.8 10.16,76.83 22.54,89.22 37.15,89.22 38.73,87.63 48.26,87.63 50.48,85.41 IC12.3
ALUBUS8  (via drill 0.61 pad 1.27)
  Top 0.406: v66.36,70.17 66.36,78.74 74.3,86.68 79.69,86.68 80.96,85.41 IC13.18
  Bottom 0.406: JP3.9 6.03,73.03 10.16,73.03 18.73,81.6 67.31,81.6 72.39,86.68 81.28,86.68 82.55,85.41 IC13.18 | IC13.9 v66.36,70.17
ALUBUS9
  Top 0.406: IC13.7 78.74,75.25 83.82,80.33 IC13.16
  Bottom 0.406: JP3.10 10.16,74.3 20,84.14 66.99,84.14 72.07,89.22 87,89.22 88.27,87.95 88.27,81.92 86.68,80.33 IC13.16
ALUBUS10
  Bottom 0.406: JP3.11 6.03,70.48 10.16,70.48 16.19,76.52 71.75,76.52 72.39,76.52 | 72.39,76.52 81.92,76.52 83.19,75.25 IC13.14 | IC13.5 76.2,80.33 72.39,76.52
ALUBUS11
  Top 0.406: IC13.12 81.28,73.98 76.2,73.98 75.56,74.61 75.56,75.88 76.2,76.52 78.74,76.52 79.38,77.15 79.38,80.96 78.74,81.6 76.2,81.6 75.56,82.23 75.56,84.77 76.2,85.41 IC13.3
  Bottom 0.406: JP3.12 10.16,71.75 17.46,79.06 66.36,79.06 72.71,85.41 IC13.3
ALUBUS12
  Bottom 0.406: JP3.13 6.03,67.94 10.16,67.94 13.65,71.44 99.06,71.44 100.33,70.17 IC14.9 104.14,70.17 107.95,73.98 107.95,77.79 109.22,79.06 112.08,79.06 113.35,80.33 113.35,84.14 112.08,85.41 IC14.18
ALUBUS13
  Bottom 0.406: JP3.14 10.16,69.22 14.92,73.98 99.06,73.98 100.33,75.25 IC14.7 104.14,75.25 109.22,80.33 IC14.16
ALUBUS14
  Top 0.406: IC14.14 109.54,75.25 104.46,80.33 IC14.5
  Bottom 0.406: IC14.14 111.76,75.25 112.39,74.61 112.39,66.99 111.76,66.36 11.11,66.36 10.16,65.41 6.03,65.41 JP3.15
ALUBUS15
  Top 0.406: IC14.12 107.63,70.17 105.41,72.39 105.41,77.79 104.14,79.06 101.28,79.06 100.01,80.33 100.01,84.14 101.28,85.41 IC14.3
  Bottom 0.406: JP3.16 10.16,66.67 12.38,68.9 106.36,68.9 107.63,70.17 IC14.12
ALUMODE
  Top 0.406: IC1.8 46.99,43.18 48.26,44.45 59.69,44.45 60.96,43.18 IC2.8 72.39,43.18 73.66,44.45 85.09,44.45 86.36,43.18 IC3.8 97.79,43.18 99.06,44.45 110.49,44.45 111.76,43.18 IC4.8
  Bottom 0.406: JP9.3 74.93,6.99 78.74,6.99 84.45,12.7 119.38,12.7 124.46,17.78 124.46,35.24 120.65,39.05 120.65,41.91 119.38,43.18 IC4.8
ALUOP0
  Top 0.406: IC1.6 46.99,38.1 48.26,36.83 59.69,36.83 60.96,38.1 IC2.6 72.39,38.1 73.66,36.83 85.09,36.83 86.36,38.1 IC3.6 97.79,38.1 99.06,36.83 110.49,36.83 111.76,38.1 IC4.6
  Bottom 0.406: JP9.4 72.39,6.99 72.39,9.21 73.34,10.16 80.64,10.16 84.14,13.65 119.06,13.65 123.51,18.1 123.51,34.92 120.33,38.1 IC4.6
ALUOP1
  Top 0.406: IC1.5 46.99,35.56 48.26,34.29 59.69,34.29 60.96,35.56 IC2.5 72.39,35.56 73.66,34.29 85.09,34.29 86.36,35.56 IC3.5 97.79,35.56 99.06,34.29 110.49,34.29 111.76,35.56 IC4.5
  Bottom 0.406: JP9.6 69.85,6.99 69.85,10.79 71.12,12.06 80.01,12.06 83.5,15.56 118.43,15.56 121.6,18.73 121.6,33.02 119.06,35.56 IC4.5
ALUOP2
  Top 0.406: IC1.4 46.99,33.02 48.26,31.75 59.69,31.75 60.96,33.02 IC2.4 72.39,33.02 73.66,31.75 85.09,31.75 86.36,33.02 IC3.4 97.79,33.02 99.06,31.75 110.49,31.75 111.76,33.02 IC4.4
  Bottom 0.406: JP9.5 71.12,9.84 72.39,11.11 80.33,11.11 83.82,14.61 118.75,14.61 122.56,18.41 122.56,34.29 120.02,36.83 116.84,36.83 115.89,35.88 115.89,33.97 116.84,33.02 IC4.4
ALUOP3
  Top 0.406: IC1.3 46.99,30.48 48.26,29.21 59.69,29.21 60.96,30.48 IC2.3 72.39,30.48 73.66,29.21 85.09,29.21 86.36,30.48 IC3.3 97.79,30.48 99.06,29.21 110.49,29.21 111.76,30.48 IC4.3
  Bottom 0.406: JP9.8 67.31,6.99 67.31,11.43 68.9,13.02 79.69,13.02 83.19,16.51 118.11,16.51 120.65,19.05 120.65,29.21 119.38,30.48 IC4.3
ALURES0  (via drill 0.61 pad 1.27)
  Top 0.406: IC11.11 35.56,67.63 37.47,65.72 37.47,48.9 40.64,45.72 IC1.9 | v41.91,21.91 41.91,7.62 42.55,6.99 44.45,6.99 JP9.25
  Bottom 0.406: IC1.9 43.18,45.72 46.35,42.55 46.35,24.77 43.5,21.91 v41.91,21.91
ALURES1
  Top 0.406: IC1.10 40.64,48.26 38.73,50.16 38.73,69.53 35.56,72.71 IC11.13 35.88,72.71 38.1,74.93 38.1,84.45 35.88,86.68 30.8,86.68 29.53,87.95 IC11.2
ALURES2  (via drill 0.61 pad 1.27)
  Top 0.406: v39.69,77.79 39.69,51.75 40.64,50.8 IC1.11 43.5,50.8 44.45,49.85 44.45,45.72 43.18,44.45 40.01,44.45 32.38,52.07 24.45,52.07 21.91,54.61 21.91,75.88 25.08,79.06 27.94,79.06 28.89,80.01 28.89,81.6 27.62,82.87 IC11.4
  Bottom 0.406: IC11.15 v39.69,77.79
ALURES3
  Top 0.406: IC1.13 25.72,53.34 22.86,56.2 22.86,75.25 25.4,77.79 IC11.6 27.94,77.79 33.02,82.87 IC11.17
ALURES4  (via drill 0.61 pad 1.27)
  Top 0.406: IC2.9 66.04,45.72 62.23,49.53 62.23,66.36 60.96,67.63 IC12.11 56.83,67.63 55.56,68.9 50.48,68.9 v49.21,67.63 | v37.47,67.63 36.2,68.9 32.07,68.9 28.26,72.71 IC11.8
  Bottom 0.406: v49.21,67.63 v37.47,67.63
ALURES5
  Top 0.406: 60.96,72.71 64.14,69.53 64.14,66.04 63.18,65.09 63.18,51.12 66.04,48.26 IC2.10 | IC12.13 60.96,72.71 | 60.96,72.71 62.87,74.61 62.87,85.41 61.59,86.68 55.88,86.68 54.61,87.95 IC12.2
ALURES6  (via drill 0.61 pad 1.27)
  Top 0.406: IC12.4 53.34,82.87 53.98,82.23 53.98,79.69 53.34,79.06 50.48,79.06 46.99,75.56 46.99,55.56 50.48,52.07 53.98,52.07 61.59,44.45 68.58,44.45 69.53,45.4 69.53,50.16 68.9,50.8 IC2.11 66.04,50.8 64.14,52.7 64.14,64.45 65.09,65.41 v65.09,77.79
  Bottom 0.406: IC12.15 v65.09,77.79
ALURES7
  Top 0.406: IC2.13 51.12,53.34 47.94,56.52 47.94,74.93 50.8,77.79 IC12.6 53.34,77.79 58.42,82.87 IC12.17
ALURES8  (via drill 0.61 pad 1.27)
  Top 0.406: IC3.9 91.44,45.72 87.31,49.85 87.31,66.67 86.36,67.63 IC13.11 82.23,67.63 80.96,68.9 75.88,68.9 v74.61,67.63 | v62.87,67.63 61.59,68.9 57.47,68.9 53.66,72.71 IC12.8 | v85.09,22.54 74.3,11.75 46.04,11.75 43.18,8.89 JP9.27
  Bottom 0.406: v74.61,67.63 v62.87,67.63 | IC3.9 91.44,45.72 85.09,39.37 v85.09,22.54
ALURES9
  Top 0.406: 86.36,72.71 89.53,69.53 89.53,66.04 88.27,64.77 88.27,51.44 89.53,50.16 90.17,49.53 91.44,48.26 IC3.10 | IC13.13 86.36,72.71 | 86.36,72.71 88.27,74.61 88.27,85.72 87.31,86.68 81.28,86.68 80.01,87.95 IC13.2
ALURES10  (via drill 0.61 pad 1.27)
  Top 0.406: IC13.4 80.01,82.87 81.28,81.6 86.68,81.6 87.31,80.96 87.31,78.42 86.68,77.79 IC13.15 | v90.49,77.79 90.49,65.72 89.22,64.45 89.22,52.7 91.12,50.8 IC3.11
  Bottom 0.406: IC13.15 v90.49,77.79
ALURES11
  Top 0.406: IC13.6 76.2,77.79 66.04,67.63 66.04,62.87 65.09,61.91 65.09,53.02 66.04,52.07 68.9,52.07 70.17,53.34 IC3.13
  Bottom 0.406: IC13.6 78.74,77.79 83.82,82.87 IC13.17
ALURES12  (via drill 0.61 pad 1.27)
  Top 0.406: IC4.9 116.84,45.72 114.94,47.62 114.94,64.45 111.76,67.63 IC14.11 107.63,67.63 106.36,68.9 101.28,68.9 v100.01,67.63 | 78.74,72.71 IC13.8 79.06,72.71 82.87,68.9 87,68.9 v88.27,67.63
  Bottom 0.406: v100.01,67.63 v88.27,67.63
ALURES13
  Top 0.406: IC14.13 111.76,72.71 | 111.76,72.71 112.71,73.66 112.71,85.72 111.76,86.68 107,86.68 105.73,87.95 IC14.2 | 111.76,72.71 115.89,68.58 115.89,49.85 117.47,48.26 IC4.10
ALURES14
  Top 0.406: IC14.15 109.54,77.79 104.46,82.87 IC14.4
  Bottom 0.406: IC4.11 116.2,50.8 112.39,54.61 112.39,64.14 113.35,65.09 113.35,76.83 112.39,77.79 IC14.15
ALURES15
  Top 0.406: IC4.13 95.57,53.34 94.3,52.07 91.12,52.07 90.17,53.02 90.17,64.14 91.44,65.41 91.44,73.66 95.57,77.79 IC14.6
  Bottom 0.406: IC14.6 104.14,77.79 109.22,82.87 IC14.17
CN+X  (via drill 0.61 pad 1.27)
  Top 0.406: IC5.12 135.25,43.18 137.48,40.96 137.48,33.34 130.81,26.67 90.49,26.67 88.9,28.26 81.28,28.26 79.69,26.67 v70.17,26.67
  Bottom 0.406: IC2.7 66.04,40.64 64.77,39.37 64.77,27.94 66.04,26.67 v70.17,26.67
CN+Y
  Top 0.406: IC3.7 97.79,40.64 99.06,39.37 129.54,39.37 130.81,40.64 IC5.11
CN+Z
  Top 0.406: IC5.9 135.25,35.56 136.21,36.51 136.21,40.96 135.25,41.91 124.46,41.91 123.19,40.64 IC4.7
G0  (via drill 0.61 pad 1.27)
  Top 0.406: IC1.17 27.94,43.18 31.75,39.37 v94.93,39.37 | v95.25,25.4 96.84,23.81 120.33,23.81 122.24,25.72 131.13,25.72 138.43,33.02 138.43,44.45 135.89,46.99 130.81,46.99 129.54,48.26 IC5.3
  Bottom 0.406: v94.93,39.37 94.93,30.16 93.98,29.21 91.12,29.21 90.49,28.57 90.49,27.3 91.12,26.67 93.98,26.67 v95.25,25.4
G1  (via drill 0.61 pad 1.27)
  Top 0.406: v113.67,58.74 v95.89,58.74 | v84.14,58.74 80.33,54.93 v70.8,54.93
  Bottom 0.406: IC5.1 127.32,53.34 127.95,53.98 127.95,56.83 126.05,58.74 v113.67,58.74 | v95.89,58.74 v84.14,58.74 | v70.8,54.93 62.23,54.93 54.61,47.31 54.61,44.45 53.34,43.18 IC2.17
G2  (via drill 0.61 pad 1.27)
  Top 0.406: v113.67,55.56 v95.89,55.56
  Bottom 0.406: v113.67,55.56 119.38,55.56 122.56,52.39 122.56,49.21 124.78,46.99 129.54,46.99 130.81,48.26 IC5.14 | v95.89,55.56 86.36,55.56 84.77,53.98 84.77,46.99 80.96,43.18 IC3.17
G3
  Top 0.406: IC4.17 110.49,43.18 111.76,41.91 123.19,41.91 124.46,43.18 IC5.5
GND  (via drill 0.61 pad 1.27)
  Top 0.813: v62.23,23.18 69.85,23.18 C10.2
  Bottom 0.813: v62.23,23.18 62.23,50.16 65.41,53.34 IC2.12
  other vias: 127.32,23.5 97.47,75.88 60.01,49.53 34.92,53.02
  pour Bottom (isolate 0.61): 0,100.01 0,74.61 0,0 160.02,0 160.02,100.01
  pour Top (isolate 0.61): 0,100.01 160.02,100.01 160.02,0 0,0
LBUS0
  Bottom 0.406: JP5.15 4.13,41.27 3.17,42.23 3.17,44.45 3.81,45.09 17.78,45.09 20.95,41.91 33.97,41.91 37.47,38.42 37.47,31.11 40.64,27.94 IC1.2
LBUS1
  Bottom 0.406: JP5.16 11.75,41.27 21.27,31.75 27.94,31.75 28.89,30.8 28.89,28.89 27.94,27.94 IC1.23
LBUS2
  Bottom 0.406: JP5.13 6.03,42.55 14.61,42.55 24.13,33.02 IC1.21
LBUS3
  Bottom 0.406: JP5.14 17.78,43.81 23.5,38.1 IC1.19
LBUS4
  Bottom 0.406: JP5.11 4.13,46.35 3.17,47.31 3.17,49.53 3.81,50.16 8.89,50.16 16.51,57.78 71.44,57.78 72.39,56.83 72.39,31.11 69.22,27.94 IC2.2
LBUS5
  Bottom 0.406: JP5.12 8.89,46.35 17.46,54.93 43.81,54.93 47.62,51.12 47.62,33.97 49.85,31.75 53.34,31.75 54.29,30.8 54.29,28.89 53.34,27.94 IC2.23
LBUS6
  Bottom 0.406: JP5.9 6.03,47.62 8.89,47.62 17.14,55.88 44.13,55.88 48.58,51.44 48.58,34.29 49.85,33.02 IC2.21
LBUS7
  Bottom 0.406: JP5.10 8.89,48.9 16.83,56.83 44.45,56.83 49.53,51.75 49.53,39.37 50.8,38.1 IC2.19
LBUS8
  Bottom 0.406: JP5.7 4.13,51.44 3.17,52.39 3.17,54.61 3.81,55.24 8.89,55.24 15.24,61.59 96.84,61.59 97.47,60.96 97.47,30.8 94.61,27.94 IC3.2
LBUS9
  Bottom 0.406: JP5.8 8.89,51.44 16.19,58.74 71.75,58.74 73.34,57.15 73.34,33.66 75.25,31.75 78.74,31.75 79.69,30.8 79.69,28.89 78.74,27.94 IC3.23
LBUS10
  Bottom 0.406: JP5.5 6.03,52.7 8.89,52.7 15.88,59.69 72.07,59.69 74.3,57.47 74.3,33.97 75.25,33.02 IC3.21
LBUS11
  Bottom 0.406: JP5.6 8.89,53.98 15.56,60.64 72.39,60.64 75.25,57.78 75.25,39.05 76.2,38.1 IC3.19
LBUS12
  Bottom 0.406: JP5.3 4.13,56.52 3.17,57.47 3.17,59.69 3.81,60.33 8.89,60.33 13.97,65.41 110.17,65.41 111.44,64.14 111.44,33.34 116.84,27.94 IC4.2
LBUS13
  Bottom 0.406: JP5.4 8.89,56.52 14.92,62.55 97.16,62.55 98.42,61.28 98.42,33.97 100.65,31.75 104.14,31.75 105.09,30.8 105.09,28.89 104.14,27.94 IC4.23
LBUS14
  Bottom 0.406: JP5.1 6.03,57.78 8.89,57.78 14.61,63.5 97.47,63.5 99.38,61.59 99.38,34.29 100.65,33.02 IC4.21
LBUS15
  Bottom 0.406: JP5.2 8.89,59.05 14.29,64.45 97.79,64.45 100.33,61.91 100.33,39.37 101.6,38.1 IC4.19
N$1  (via drill 0.61 pad 1.27)
  Top 0.406: IC14.1 93.98,90.49 92.71,89.22 81.28,89.22 80.01,90.49 IC13.1 77.15,90.81 68.58,90.81 66.99,89.22 55.88,89.22 54.61,90.49 IC12.1 | v40.64,90.49 39.37,89.22 30.48,89.22 29.21,90.49 IC11.1
  Bottom 0.406: IC19.6 117.16,72.07 117.16,84.77 115.25,86.68 107.95,86.68 104.14,90.49 IC14.1 | IC12.1 v40.64,90.49
N$4
  Top 0.406: IC19.2 121.92,80.33 123.19,79.06 136.53,79.06 137.48,78.11 137.48,71.12 136.53,70.17 IC18.6
N$5  (via drill 0.61 pad 1.27)
  Top 0.406: IC14.19 107,87.95 105.73,89.22 93.98,89.22 92.71,87.95 IC13.19 81.28,87.95 80.01,89.22 68.26,89.22 66.99,87.95 IC12.19 55.88,87.95 54.61,89.22 v49.21,89.22 | v41.91,89.22 40.64,87.95 IC11.19
  Bottom 0.406: IC19.3 120.02,77.79 121.28,79.06 121.28,83.82 117.16,87.95 IC14.19 | v49.21,89.22 v41.91,89.22
P0  (via drill 0.61 pad 1.27)
  Top 0.406: IC1.15 27.94,48.26 34.29,41.91 110.49,41.91 111.76,40.64 v114.3,40.64
  Bottom 0.406: v114.3,40.64 114.3,45.72 115.57,46.99 122.56,46.99 123.83,45.72 IC5.4
P1  (via drill 0.61 pad 1.27)
  Top 0.406: v113.67,60.33 v95.89,60.33 | v83.5,60.33 79.69,56.52 v70.17,56.52
  Bottom 0.406: IC5.2 127.32,50.8 128.91,52.39 128.91,57.15 125.73,60.33 v113.67,60.33 | v95.89,60.33 v83.5,60.33 | v70.17,56.52 60.96,56.52 52.7,48.26 IC2.15
P2  (via drill 0.61 pad 1.27)
  Top 0.406: v113.67,57.15 v95.89,57.15
  Bottom 0.406: v113.67,57.15 119.06,57.15 123.51,52.7 123.51,50.8 124.78,49.53 129.54,49.53 130.81,50.8 IC5.15 | v95.89,57.15 86.04,57.15 83.82,54.93 83.82,50.8 81.28,48.26 IC3.15
P3  (via drill 0.61 pad 1.27)
  Top 0.406: v120.65,44.45 111.76,44.45 107.95,48.26 IC4.15
  Bottom 0.406: IC5.6 124.46,40.64 v120.65,44.45
RBUS0
  Bottom 0.406: JP4.1 3.17,32.07 3.17,30.48 3.81,29.84 8.57,29.84 16.83,21.59 29.84,21.59 33.66,25.4 IC1.1
RBUS1
  Bottom 0.406: JP4.2 8.89,33.66 12.06,30.48 IC1.22
RBUS2
  Bottom 0.406: JP4.3 6.03,32.38 8.57,32.38 17.46,23.5 29.21,23.5 30.16,24.45 30.16,33.02 27.62,35.56 IC1.20
RBUS3
  Bottom 0.406: JP4.4 8.57,31.11 17.14,22.54 29.53,22.54 31.11,24.13 31.11,38.1 28.57,40.64 IC1.18
RBUS4
  Bottom 0.406: JP4.5 3.17,26.99 3.17,25.4 3.81,24.77 8.57,24.77 15.56,17.78 52.39,17.78 56.2,21.59 65.41,21.59 67.31,23.5 IC2.1
RBUS5
  Bottom 0.406: JP4.6 8.57,28.57 16.51,20.64 47.62,20.64 49.53,22.54 49.53,29.53 50.48,30.48 50.8,30.48 51.44,30.48 IC2.22
RBUS6
  Bottom 0.406: JP4.7 6.03,27.3 8.57,27.3 16.19,19.68 51.75,19.68 55.56,23.5 55.56,33.02 53.02,35.56 IC2.20
RBUS7
  Bottom 0.406: JP4.8 8.57,26.04 15.88,18.73 52.07,18.73 56.52,23.18 56.52,38.1 53.98,40.64 IC2.18
RBUS8
  Bottom 0.406: JP4.9 3.17,21.91 3.17,20.64 4.13,19.68 8.57,19.68 14.29,13.97 53.66,13.97 57.47,17.78 78.11,17.78 81.6,21.27 90.17,21.27 92.71,23.81 IC3.1
RBUS9
  Bottom 0.406: JP4.10 8.57,23.5 15.24,16.83 52.7,16.83 56.52,20.64 66.36,20.64 76.2,30.48 IC3.22
RBUS10
  Bottom 0.406: JP4.11 6.03,22.23 8.57,22.23 14.92,15.88 53.02,15.88 56.83,19.68 77.47,19.68 80.96,23.18 80.96,33.02 78.42,35.56 IC3.20
RBUS11
  Bottom 0.406: JP4.12 8.57,20.95 14.61,14.92 53.34,14.92 57.15,18.73 77.79,18.73 81.92,22.86 81.92,38.1 79.38,40.64 IC3.18
RBUS12
  Bottom 0.406: JP4.13 3.17,16.83 3.17,14.92 4.13,13.97 9.21,13.97 13.02,10.16 54.93,10.16 58.74,13.97 79.38,13.97 82.87,17.46 114.62,17.46 118.11,20.95 IC4.1
RBUS13
  Bottom 0.406: JP4.14 8.57,18.41 13.97,13.02 53.98,13.02 57.78,16.83 78.42,16.83 81.92,20.32 91.76,20.32 101.92,30.48 IC4.22
RBUS14
  Bottom 0.406: JP4.15 6.03,17.14 8.57,17.14 13.65,12.06 54.29,12.06 58.1,15.88 78.74,15.88 82.23,19.37 103.82,19.37 106.36,21.91 106.36,33.02 103.82,35.56 IC4.20
RBUS15
  Bottom 0.406: JP4.16 8.57,15.88 13.34,11.11 54.61,11.11 58.42,14.92 79.06,14.92 82.55,18.41 104.14,18.41 107.31,21.59 107.31,38.1 104.78,40.64 IC4.18

### Text on the board
Top: #5
tsilk: VCC2 | GND1 | 74LS244N | 74LS244N | 74LS244N | 74LS244N | JP3 | 74LS32N | 74LS04N | IC11 | IC12 | IC13 | IC14 | IC19 | IC18 | JP5 | IC5 | 74S182N | JP4 | JP2 | 74LS181N | 74LS181N | 74LS181N | 74LS181N | IC1 | IC2 | IC3 | IC4 | GND2 | VCC1 | JP9 | JP10 | 10u